# EAGLE design GB PCB - Tetris DX (EAGLE 6.2)
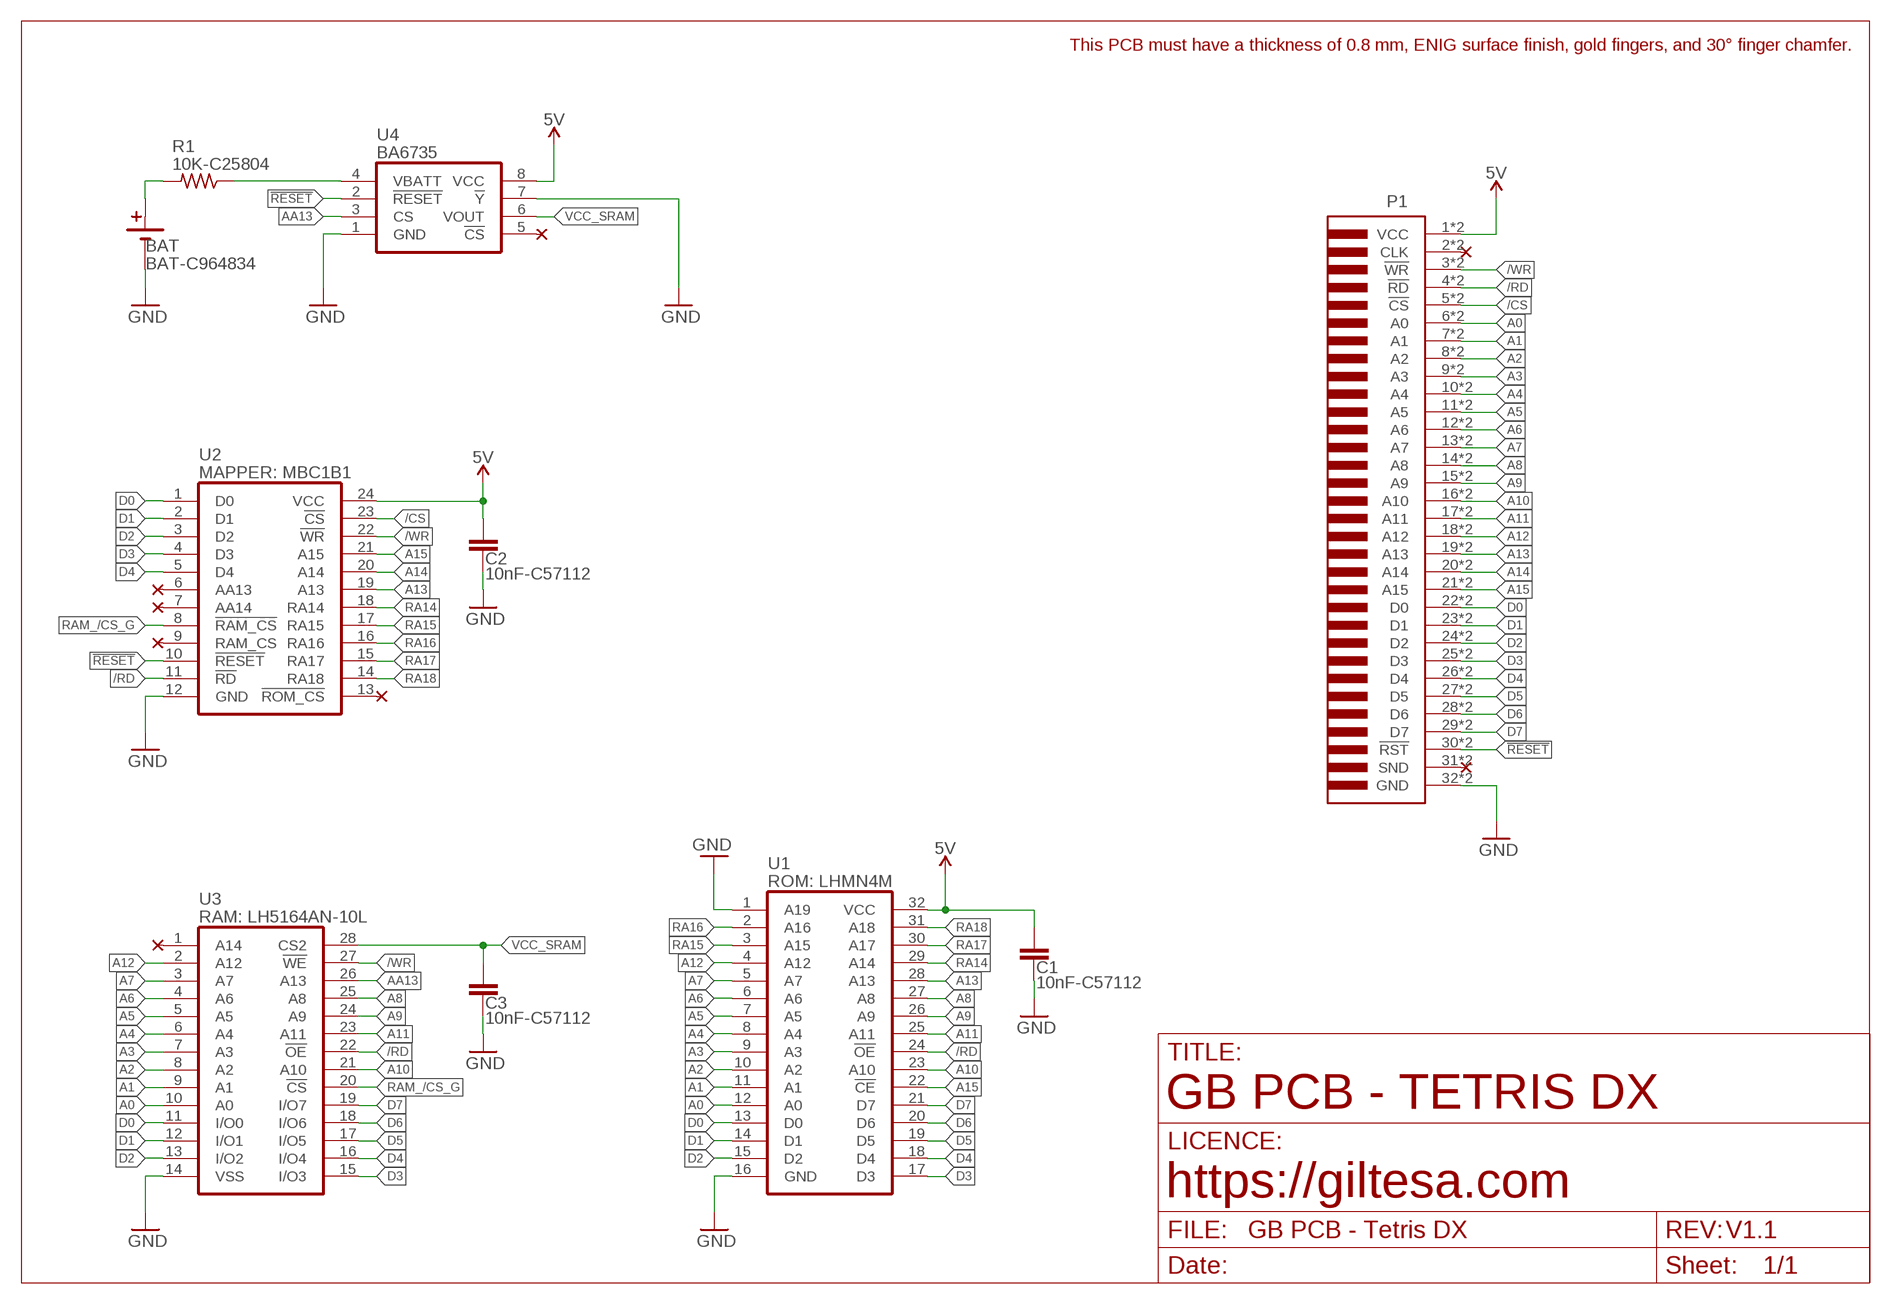
[diagram p0: schematic, sheet 1]

## Parts
BAT  BAT-C964834  CR2032MY-2032-12-R  [CR2032_MY-2032-12-R]
C1  10nF-C57112  C0603"  [C0603]
C2  10nF-C57112  C0603"  [C0603]
C3  10nF-C57112  C0603"  [C0603]
P1  GB_CARTRIDGE  [GB_CARTRIDGE]
R1  10K-C25804  R0603  [R0603]
U1  ROM: LHMN4M  LHMN4M  [LHMN4M]
U2  MAPPER: MBC1B1  MBC1B1  [MBC1B1]
U3  RAM: LH5164AN-10L  LH5164AN-10L  [LH5164AN-10L]
U4  BA6735  [BA6735]

## Nets
5V: C1.2 C2.1 P1.1"(VCC) P1.1(VCC) U1.32(VCC) U2.24(VCC) U4.8(VCC)
!RESET: P1.30"(!RST) P1.30(!RST) U2.10(!RESET) U4.2(!RESET)
/CS: P1.5"(!CS) P1.5(!CS) U2.23(!CS)
/RD: P1.4"(!RD) P1.4(!RD) U1.24(!OE) U2.11(!RD) U3.22(!OE)
/WR: P1.3"(!WR) P1.3(!WR) U2.22(!WR) U3.27(!WE)
A0: P1.6"(A0) P1.6(A0) U1.12(A0) U3.10(A0)
A1: P1.7"(A1) P1.7(A1) U1.11(A1) U3.9(A1)
A2: P1.8"(A2) P1.8(A2) U1.10(A2) U3.8(A2)
A3: P1.9"(A3) P1.9(A3) U1.9(A3) U3.7(A3)
A4: P1.10"(A4) P1.10(A4) U1.8(A4) U3.6(A4)
A5: P1.11"(A5) P1.11(A5) U1.7(A5) U3.5(A5)
A6: P1.12"(A6) P1.12(A6) U1.6(A6) U3.4(A6)
A7: P1.13"(A7) P1.13(A7) U1.5(A7) U3.3(A7)
A8: P1.14"(A8) P1.14(A8) U1.27(A8) U3.25(A8)
A9: P1.15"(A9) P1.15(A9) U1.26(A9) U3.24(A9)
A10: P1.16"(A10) P1.16(A10) U1.23(A10) U3.21(A10)
A11: P1.17"(A11) P1.17(A11) U1.25(A11) U3.23(A11)
A12: P1.18"(A12) P1.18(A12) U1.4(A12) U3.2(A12)
A13: P1.19"(A13) P1.19(A13) U1.28(A13) U2.19(A13)
A14: P1.20"(A14) P1.20(A14) U2.20(A14)
A15: P1.21"(A15) P1.21(A15) U1.22(!CE) U2.21(A15)
AA13: U3.26(A13) U4.3(CS)
D0: P1.22"(D0) P1.22(D0) U1.13(D0) U2.1(D0) U3.11(I/O0)
D1: P1.23"(D1) P1.23(D1) U1.14(D1) U2.2(D1) U3.12(I/O1)
D2: P1.24"(D2) P1.24(D2) U1.15(D2) U2.3(D2) U3.13(I/O2)
D3: P1.25"(D3) P1.25(D3) U1.17(D3) U2.4(D3) U3.15(I/O3)
D4: P1.26"(D4) P1.26(D4) U1.18(D4) U2.5(D4) U3.16(I/O4)
D5: P1.27"(D5) P1.27(D5) U1.19(D5) U3.17(I/O5)
D6: P1.28"(D6) P1.28(D6) U1.20(D6) U3.18(I/O6)
D7: P1.29"(D7) P1.29(D7) U1.21(D7) U3.19(I/O7)
GND: BAT.GND1(B-) BAT.GND2(B-) BAT.GND3(B-) C1.1 C2.2 C3.2 P1.32"(GND) P1.32(GND) U1.1(A19) U1.16(GND) U2.12(GND) U3.14(VSS) U4.1(GND) U4.7(!Y)
N$1: BAT.VCC1(B+) BAT.VCC2(B+) R1.2
N$16: R1.1 U4.4(VBATT)
RA14: U1.29(A14) U2.18(RA14)
RA15: U1.3(A15) U2.17(RA15)
RA16: U1.2(A16) U2.16(RA16)
RA17: U1.30(A17) U2.15(RA17)
RA18: U1.31(A18) U2.14(RA18)
RAM_/CS_G: U2.8(!RAM_CS) U3.20(!CS)
VCC_SRAM [VCC]: C3.1 U3.28(CS2) U4.6(VOUT)
Unconnected: P1.2"(CLK) P1.2(CLK) P1.31"(SND) P1.31(SND) U2.6(AA13) U2.7(AA14) U2.9(RAM_CS) U2.13(!ROM_CS) U3.1(A14) U4.5(!CS)

## Notes on the sheet
- This PCB must have a thickness of 0.8 mm, ENIG surface finish, gold fingers, and 30° finger chamfer.
- GB PCB - TETRIS DX
- https://giltesa.com
- V1.1

## Library data of the parts
BAT = ,giltesa:CR2032
C1-C3 = ,giltesa:C0603
P1 = ,giltesa:GB_CARTRIDGE
R1 = ,giltesa:R0603
U1 = ,giltesa:LHMN4M
U2 = ,giltesa:MBC1B1
U3 = ,giltesa:LH5164AN-10L
U4 = ,giltesa:BA6735

## Net classes
1 VCC: width 0.203 mm
2 GND: width 0.203 mm
3 power usb: width 0.508 mm, drill 0.406 mm, clearance 0.203 mm

## Board
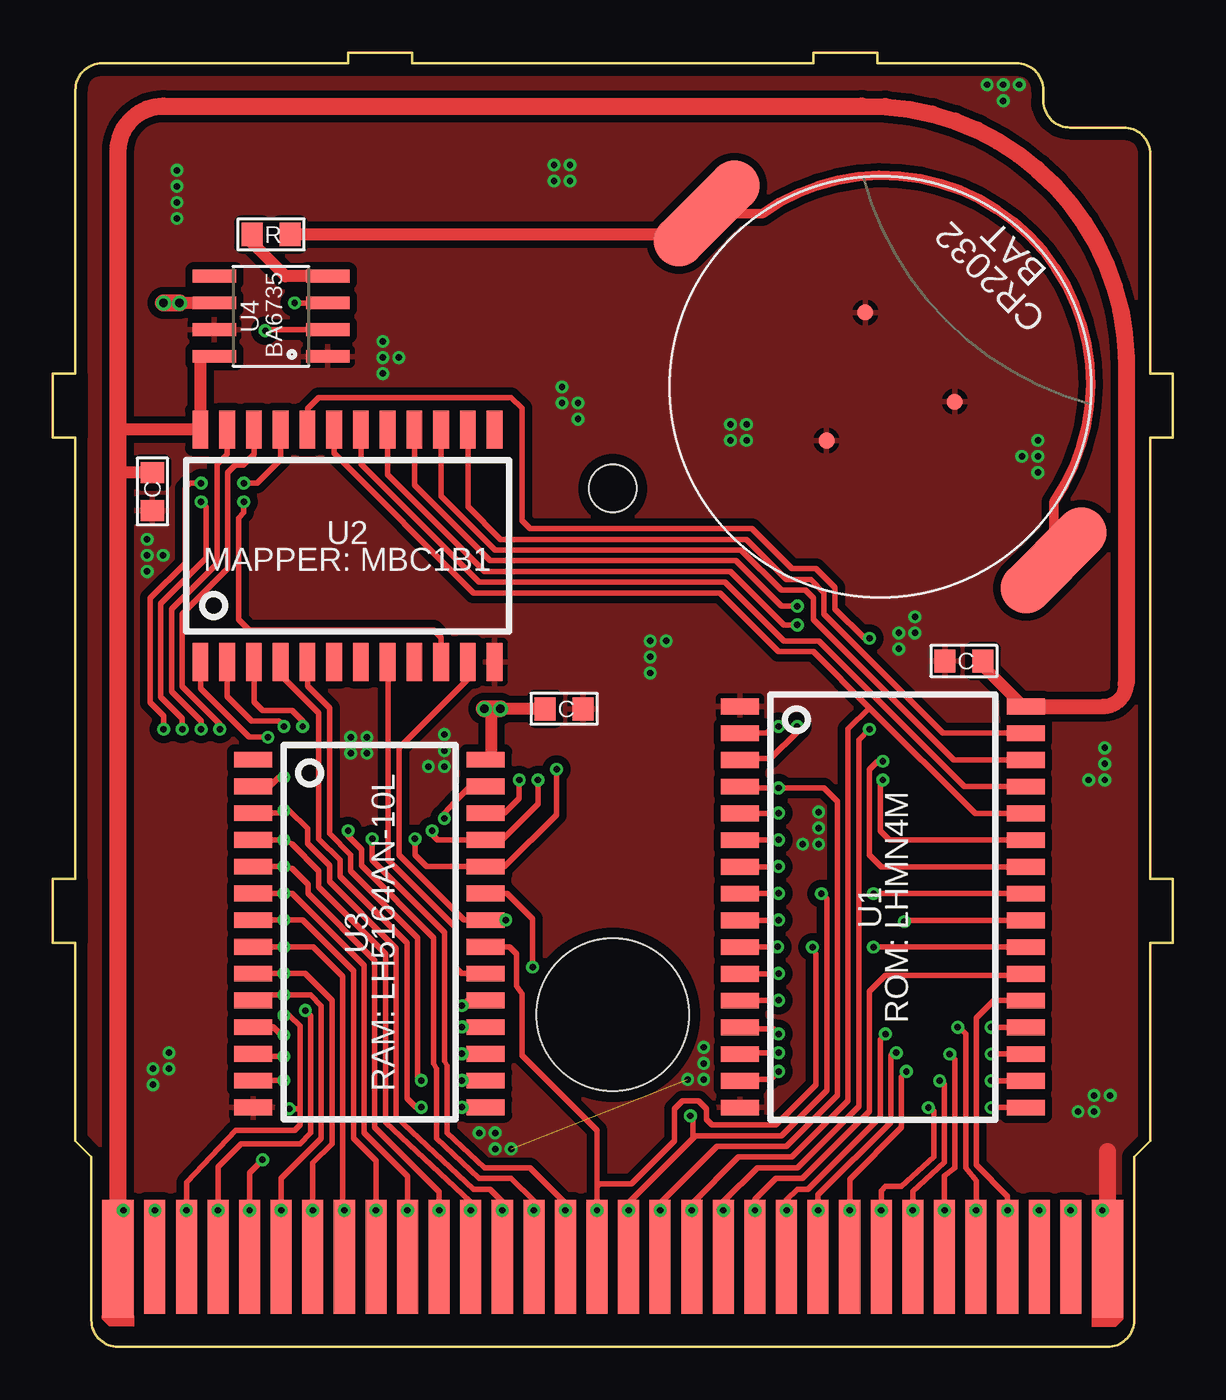
[diagram p1: board, top side]
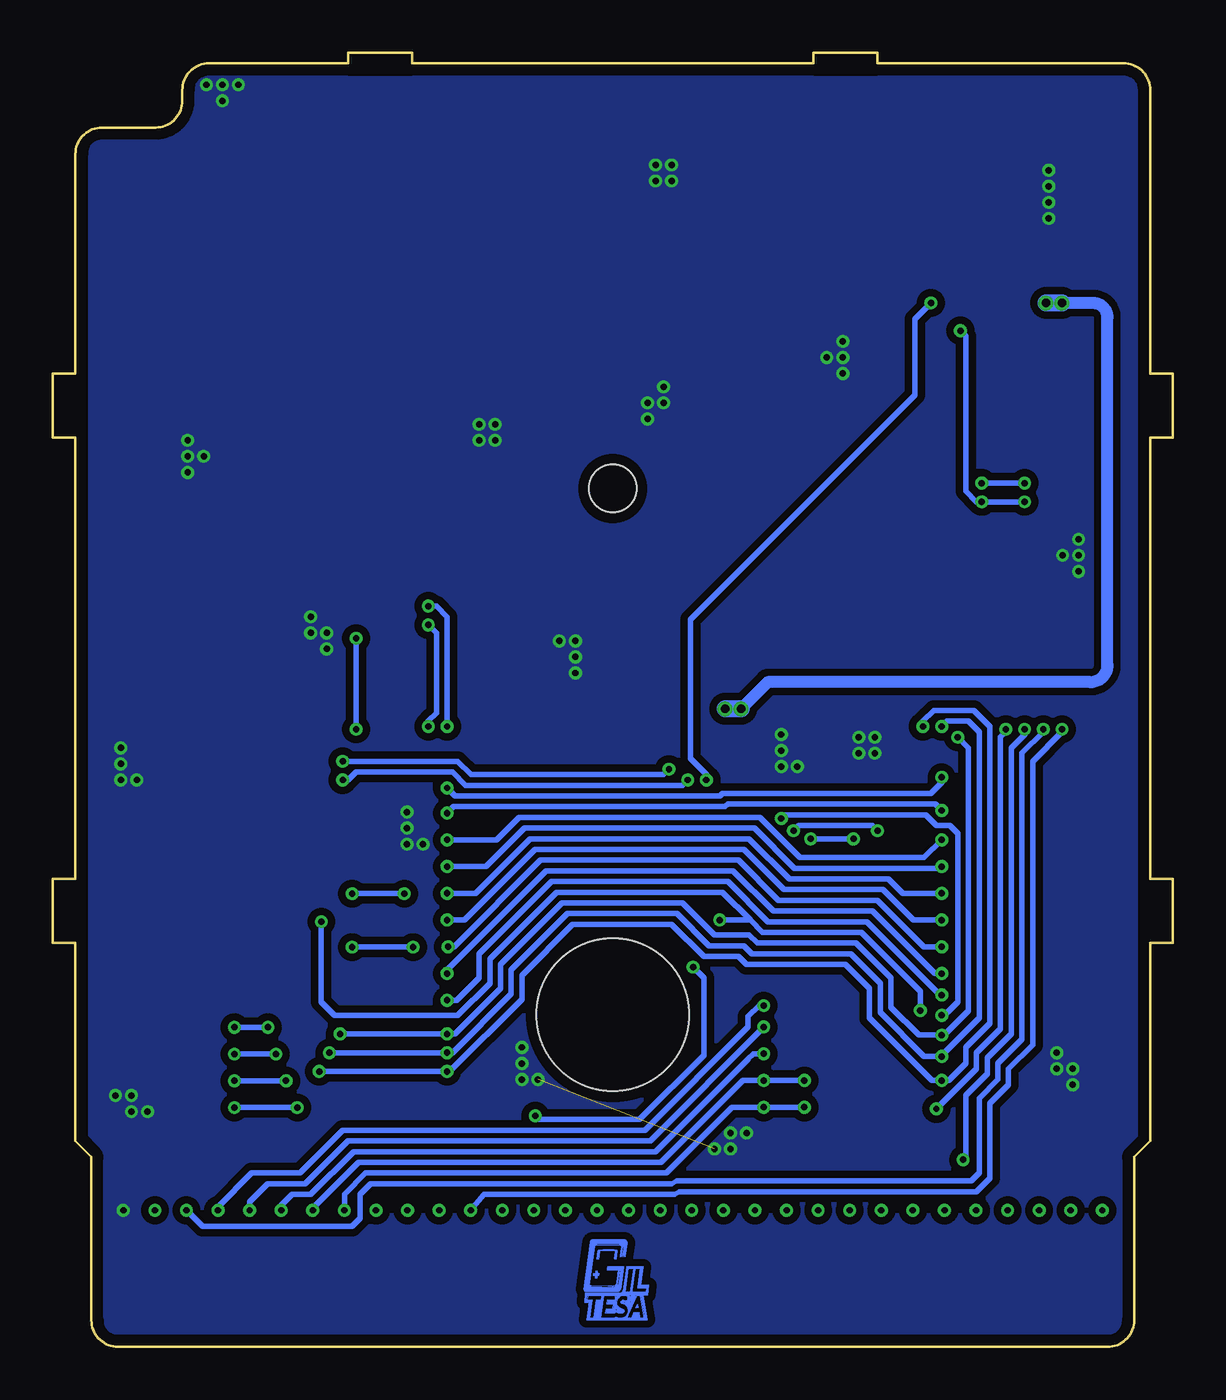
[diagram p2: board, bottom side, seen from below]

Size 53.21 x 61.47 mm. Coordinates in mm from the lower left corner, seen from the top.
Outline: 1.84,9.02 1.84,1.27 arc90 3.11,0 50.1,0 arc90 51.37,1.27 51.37,9.02 52.13,9.78 52.13,19.18 53.21,19.18 53.21,22.23 52.13,22.23 52.13,43.18 53.21,43.18 53.21,46.23 52.13,46.23 52.13,56.64 arc90 50.86,57.91 48.32,57.91 arc-90 47.05,59.18 47.05,59.69 arc90 45.78,60.96 39.18,60.96 39.18,61.47 36.13,61.47 36.13,60.96 17.08,60.96 17.08,61.47 14.03,61.47 14.03,60.96 2.35,60.96 arc90 1.08,59.69 1.08,46.23 0,46.23 0,43.18 1.08,43.18 1.08,22.23 0,22.23 0,19.18 1.08,19.18 1.08,9.78 1.84,9.02
Copper layers (1*16): Top 0.035mm / dielectric 1.6mm / Bottom 0.035mm
Design rules: minimum track width 6mil, minimum drill 12mil, track to track 6mil, track to pad 6mil, pad to pad 6mil, via to via 8mil, smd to smd 0mil, copper to edge 20mil, drill to drill 10mil, minimum pad ring 6mil, minimum via ring 6mil, stop-mask expansion 0mil, vias tented up to drill 100mil, thermal gap 10mil

### Footprints (pad centres in the part's own frame; a part is rotated, then mirrored left to right if it is on the bottom)
CR2032_MY-2032-12-R = smd 0.75 x 0.75: GND1 -3,2; GND2 3,2; GND3 0,-3.607 | smd 2.4 x 6.1: VCC1 -11.65,0; VCC2 11.65,0
C0603 = smd 1 x 1.1: 1 -0.901,0; 2 0.901,0
GB_CARTRIDGE = smd 1.5 x 5.6: 1 -23.5,-26.305; 32 23.5,-26.305 | drill 0.305: 1" -23.25,-23.995; 2" -21.75,-23.995; 3" -20.25,-23.995; 4" -18.75,-23.995; 5" -17.25,-23.995; 6" -15.75,-23.995; 7" -14.25,-23.995; 8" -12.75,-23.995; 9" -11.25,-23.995; 10" -9.75,-23.995; 11" -8.25,-23.995; 12" -6.75,-23.995; 13" -5.25,-23.995; 14" -3.75,-23.995; 15" -2.25,-23.995; 16" -0.75,-23.995; 17" 0.75,-23.995; 18" 2.25,-23.995; 19" 3.75,-23.995; 20" 5.25,-23.995; 21" 6.75,-23.995; 22" 8.25,-23.995; 23" 9.75,-23.995; 24" 11.25,-23.995; 25" 12.75,-23.995; 26" 14.25,-23.995; 27" 15.75,-23.995; 28" 17.25,-23.995; 29" 18.75,-23.995; 30" 20.25,-23.995; 31" 21.75,-23.995; 32" 23.25,-23.995 | smd 1 x 5.4: 2 -21.75,-26.205; 3 -20.25,-26.205; 4 -18.75,-26.205; 5 -17.25,-26.205; 6 -15.75,-26.205; 7 -14.25,-26.205; 8 -12.75,-26.205; 9 -11.25,-26.205; 10 -9.75,-26.205; 11 -8.25,-26.205; 12 -6.75,-26.205; 13 -5.25,-26.205; 14 -3.75,-26.205; 15 -2.25,-26.205; 16 -0.75,-26.205; 17 0.75,-26.205; 18 2.25,-26.205; 19 3.75,-26.205; 20 5.25,-26.205; 21 6.75,-26.205; 22 8.25,-26.205; 23 9.75,-26.205; 24 11.25,-26.205; 25 12.75,-26.205; 26 14.25,-26.205; 27 15.75,-26.205; 28 17.25,-26.205; 29 18.75,-26.205; 30 20.25,-26.205; 31 21.75,-26.205 | hole 7.25: 0,-14.705 | hole 2.25: 0,10.29
R0603 = smd 1 x 1.1: 1 -0.901,0; 2 0.901,0
LHMN4M = smd 0.75 x 1.8: 1 -9.538,-6.79; 2 -8.268,-6.79; 3 -6.998,-6.79; 4 -5.728,-6.79; 5 -4.458,-6.79; 6 -3.188,-6.79; 7 -1.918,-6.79; 8 -0.648,-6.79; 9 0.622,-6.79; 10 1.892,-6.79; 11 3.162,-6.79; 12 4.432,-6.79; 13 5.702,-6.79; 14 6.972,-6.79; 15 8.242,-6.79; 16 9.512,-6.79; 17 9.512,6.79; 18 8.242,6.79; 19 6.972,6.79; 20 5.702,6.79; 21 4.432,6.79; 22 3.162,6.79; 23 1.892,6.79; 24 0.622,6.79; 25 -0.648,6.79; 26 -1.918,6.79; 27 -3.188,6.79; 28 -4.458,6.79; 29 -5.728,6.79; 30 -6.998,6.79; 31 -8.268,6.79; 32 -9.538,6.79
MBC1B1 = smd 0.75 x 1.8: 1 -6.985,-5.521; 2 -5.715,-5.521; 3 -4.445,-5.521; 4 -3.175,-5.521; 5 -1.905,-5.521; 6 -0.635,-5.521; 7 0.635,-5.521; 8 1.905,-5.521; 9 3.175,-5.521; 10 4.445,-5.521; 11 5.715,-5.521; 12 6.985,-5.521; 13 6.985,5.521; 14 5.715,5.521; 15 4.445,5.521; 16 3.175,5.521; 17 1.905,5.521; 18 0.635,5.521; 19 -0.635,5.521; 20 -1.905,5.521; 21 -3.175,5.521; 22 -4.445,5.521; 23 -5.715,5.521; 24 -6.985,5.521
LH5164AN-10L = smd 0.75 x 1.8: 1 -8.204,-5.521; 2 -6.934,-5.521; 3 -5.664,-5.521; 4 -4.394,-5.521; 5 -3.124,-5.521; 6 -1.854,-5.521; 7 -0.584,-5.521; 8 0.686,-5.521; 9 1.956,-5.521; 10 3.226,-5.521; 11 4.496,-5.521; 12 5.766,-5.521; 13 7.036,-5.521; 14 8.306,-5.521; 15 8.306,5.521; 16 7.036,5.521; 17 5.766,5.521; 18 4.496,5.521; 19 3.226,5.521; 20 1.956,5.521; 21 0.686,5.521; 22 -0.584,5.521; 23 -1.854,5.521; 24 -3.124,5.521; 25 -4.394,5.521; 26 -5.664,5.521; 27 -6.934,5.521; 28 -8.204,5.521
BA6735 = smd 0.61 x 2.057: 1 -1.905,-2.692; 2 -0.635,-2.692; 3 0.635,-2.692; 4 1.905,-2.692; 5 1.905,2.692; 6 0.635,2.692; 7 -0.635,2.692; 8 -1.905,2.692

### Placement (x,y rotation side)
BAT  39.31,45.59 315 top
C1  43.28,32.58 0 top
C2  4.74,40.63 270 top
C3  24.3,30.3 0 top
P1  26.61,30.48 0 top
R1  10.38,52.83 0 top
U1  39.43,20.88 270 top
U2  14.01,38.05 0 top
U3  15.05,19.69 270 top
U4  10.38,48.95 90 top
U$12  [GILTESA_LOGO_COPPER]  28,1.27 0 bottom
U$13  [GILTESA.COM_7MM_STOP]  42.85,2.51 0 bottom

### Tracks (layer width: path | path; a pad name or v marks a point on that pad's centre or on a via)
5V
  Top 0.254: 3.11,1.38 P1.1
  Top 0.406: C1.2 44.13,32.58 44.13,32.89 44.18,32.89 44.18,32.33
  Top 0.559: 3.11,47.04 3.11,46.99 | 3.11,43.57 U2.24 7.02,46.97 7.1,47.04 U4.8 | C2.1 3.11,41.53 3.11,41.91 | P1.1 3.11,6.23 P1.1" | 44.18,32.33 46.1,30.42 U1.32
  Top 0.711: U1.32 49.91,30.42 arc90 50.99,31.5
  Top 0.813: 50.99,31.5 50.99,46.99 arc90 38.42,58.93 5.27,58.93 arc90 3.11,56.76 3.11,46.99 3.11,43.57 3.11,41.91 P1.1
!RESET  (via drill 0.3)
  Top 0.254: P1.30 P1.30" | U2.10 18.45,33.68 18.1,34.04 9.33,34.04 8.83,34.54 8.83,39.37 9.08,39.62 v9.08,40.13 | U4.2 10.15,48.31 v10.1,48.26 | v7.05,40.13 7.3,39.88 7.3,37.47 5.14,35.31 5.14,30.86 6.16,29.84 v6.16,29.34
  Bottom 0.254: v7.05,40.13 v9.08,40.13 9.33,40.13 9.84,40.64 9.84,48.01 v10.1,48.26 | v6.16,29.34 6.16,29.21 7.18,28.19 7.18,14.61 8.32,13.46 8.32,12.7 9.21,11.81 9.21,8.25 9.59,7.87 23.56,7.87 23.81,7.75 38.1,7.75 38.61,7.24 38.61,6.1 38.99,5.71 46.09,5.71 P1.30"
/CS  (via drill 0.3)
  Top 0.254: P1.5 P1.5" 9.36,8.28 v9.97,8.89 | U2.23 8.29,42.39 7.81,41.91 7.81,37.21 5.65,35.05 5.65,31.12 7.05,29.72 v7.05,29.34
  Bottom 0.254: v7.05,29.34 7.05,29.08 7.68,28.45 7.68,14.86 8.83,13.72 8.83,12.95 9.84,11.94 9.84,9.02 v9.97,8.89
/RD  (via drill 0.3)
  Top 0.254: P1.4 P1.4" | P1.4" 7.86,6.78 | P1.4" 7.86,8.55 8.95,9.65 11.75,9.65 12.26,10.16 12.26,15.72 v12,15.98 | v21.53,20.27 U3.22 19.55,20.27 16.45,23.37 16.45,28.45 19.72,31.73 U2.11 | U1.24 40.51,20.26 v40.45,20.19
  Bottom 0.254: 20.08,20.27 19.49,19.69 14.8,19.69 12,16.89 v12,15.98 | 20.08,20.27 21.4,21.59 29.27,21.59 32.45,18.41 32.45,17.27 33.97,15.75 39.81,15.75 40.45,16.38 v40.45,20.19 | v21.53,20.27 20.08,20.27
/WR  (via drill 0.3)
  Top 0.254: P1.3 P1.3" 6.36,7.82 8.7,10.29 11.49,10.29 11.75,10.54 11.75,11.3 | U2.22 9.56,42.39 9.06,41.88 8.67,41.88 8.32,41.53 8.32,36.96 6.16,34.8 6.16,31.37 7.94,29.59 v7.94,29.34 | U3.27 19.82,26.62 19.11,25.91 18.61,25.35 v18.61,25.09 | v10.99,15.75 11.24,15.75 11.75,15.24 11.75,11.3 | v11.24,11.3 11.75,11.3
  Bottom 0.254: v10.99,15.75 10.86,15.75 10.22,16.38 10.22,24.38 10.6,24.77 11.24,24.77 11.75,25.27 18.43,25.27 v18.61,25.09 | v7.94,29.34 7.94,29.21 8.19,28.96 8.19,15.11 9.33,13.97 9.33,13.21 v11.24,11.3
A0  (via drill 0.3)
  Top 0.254: U1.12 34.47,16.45 v34.48,16.46 | P1.6 P1.6" 10.86,8 12.76,9.91 12.76,16.2 12.26,16.71 v10.99,16.71 9.91,16.71 U3.10 9.79,16.46 9.97,16.64
  Bottom 0.254: v34.48,16.46 34.47,16.45 34.04,16.45 32.96,17.53 32.96,18.67 29.53,22.1 21.15,22.1 19.24,20.19 14.54,20.19 11.06,16.71 v10.99,16.71
A1  (via drill 0.3)
  Top 0.254: U3.9 v10.99,17.73 12,17.73 13.27,16.46 13.27,9.65 12.36,8.74 P1.7" P1.7 | U1.11 34.47,17.72 v34.48,17.73
  Bottom 0.254: v34.48,17.73 34.48,17.91 29.78,22.61 20.89,22.61 18.99,20.7 14.29,20.7 11.32,17.73 v10.99,17.73
A2  (via drill 0.3)
  Top 0.254: U3.8 v10.99,19 12.38,19 13.78,17.6 13.78,6.66 P1.8" P1.8 | U1.10 34.47,18.99 v34.43,19
  Bottom 0.254: v34.43,19 34.15,19 30.04,23.11 20.64,23.11 18.73,21.21 14.03,21.21 11.82,19 v10.99,19
A3  (via drill 0.3)
  Top 0.254: U3.7 v10.99,20.27 11.87,20.27 14.29,17.86 14.29,9.91 15.36,8.84 P1.9" P1.9 | U1.9 34.47,20.26 v34.48,20.27
  Bottom 0.254: v34.48,20.27 33.64,20.27 30.29,23.62 20.38,23.62 18.48,21.72 13.78,21.72 12.33,20.27 v10.99,20.27
A4  (via drill 0.3)
  Top 0.254: U3.6 v10.99,21.54 11.37,21.54 14.8,18.11 14.8,10.16 16.86,8.1 P1.10" P1.10 | U1.8 34.47,21.53 v34.48,21.54
  Bottom 0.254: v34.48,21.54 33.13,21.54 30.54,24.13 20.63,24.13 20.13,24.13 18.22,22.23 13.53,22.23 12.84,21.54 v10.99,21.54
A5  (via drill 0.3)
  Top 0.254: U3.5 v10.99,22.81 11.37,22.73 12.13,21.97 12.13,21.54 15.3,18.36 15.3,10.41 18.36,7.36 P1.11" P1.11 | U1.7 34.47,22.8 v34.48,22.81
  Bottom 0.254: v34.48,22.81 32.63,22.81 30.8,24.64 19.88,24.64 17.97,22.73 11.06,22.73 v10.99,22.81
A6  (via drill 0.3)
  Top 0.254: U3.4 v10.99,24.08 11.37,23.88 12.64,22.61 12.64,21.84 15.81,18.67 15.81,10.67 19.86,6.88 P1.12" P1.12 | U1.6 34.47,24.07 v34.48,24.08
  Bottom 0.254: v34.48,24.08 32.12,24.08 31.05,25.15 19.62,25.15 17.72,23.24 11.82,23.24 v10.99,24.08
A7  (via drill 0.3)
  Top 0.254: U1.5 34.59,25.34 v34.48,25.35 | P1.13 P1.13" 21.36,6.9 20.76,7.49 20,7.49 16.32,10.92 16.32,18.92 13.14,22.1 13.14,22.86 12.1,23.9 12.1,24.61 11.24,25.48 v10.99,25.48 10.86,25.35 U3.3
  Bottom 0.254: v34.48,25.35 34.18,25.65 21.27,25.65 21.15,25.78 11.29,25.78 v10.99,25.48
A8  (via drill 0.3)
  Top 0.254: P1.14 P1.14" 22.86,6.93 21.78,8 20.26,8 18.22,9.91 18.22,13.21 18.1,13.46 18.1,19.43 14.67,22.86 14.67,23.62 14.03,24.26 v14.03,24.51 | v23.05,26.92 23.05,25.78 21.35,24.08 U3.25 18.28,24.08 18.02,24.33 v18.02,24.51 | v39.43,26.92 39.31,26.8 39.31,24.51 39.75,24.07 U1.27
  Bottom 0.254: v23.05,26.92 23.3,26.67 33.59,26.67 34.23,27.3 38.8,27.3 39.18,26.92 v39.43,26.92 | v14.03,24.51 14.29,24.77 17.77,24.77 v18.02,24.51
A9  (via drill 0.3)
  Top 0.254: P1.15 P1.15" 24.36,6.82 22.67,8.51 20.51,8.51 18.73,10.16 18.73,13.34 18.61,13.59 18.61,19.69 15.18,23.11 v15.18,24.13 | v23.94,27.43 23.94,25.27 21.48,22.81 U3.24 17.77,22.81 17.21,23.37 v17.21,24.13 | v39.43,27.81 39.18,27.81 38.8,27.43 38.8,23.37 39.37,22.8 U1.26
  Bottom 0.254: v39.43,27.81 33.97,27.81 33.34,27.18 24.19,27.18 v23.94,27.43 | v15.18,24.13 v17.21,24.13
A10  (via drill 0.3)
  Top 0.254: P1.16 P1.16" 25.86,7.62 | U1.23 v38.99,18.99 | v36.09,18.99 36.26,18.67 36.26,12.45 34.35,10.54 31.31,10.54 31.05,10.8 31.05,11.3 30.67,11.68 29.91,11.68 29.53,11.3 29.53,9.78 27.5,7.75 25.98,7.75 25.86,7.62 | U3.21 21.7,19 22.03,18.67 22.03,17.14 22.29,16.76 22.29,13.84 25.86,10.28 25.86,7.62
  Bottom 0.254: v38.99,18.99 v36.09,18.99
A11  (via drill 0.3)
  Top 0.254: P1.17 P1.17" 27.36,6.85 30.42,9.91 | U1.25 v38.99,21.53 | v36.51,21.53 36.77,21.27 36.77,12.19 34.61,10.03 30.54,10.03 30.42,9.91 | v22.8,18.03 22.8,20.32 21.58,21.54 U3.23 | 30.42,9.91 30.42,10.85 v30.29,10.97
  Bottom 0.254: v38.99,21.53 v36.51,21.53 | v30.29,10.97 30.16,10.8 25.34,10.8 22.29,13.84 22.29,17.53 v22.8,18.03
A12  (via drill 0.3)
  Top 0.254: P1.18 P1.18" 28.86,6.82 31.56,9.53 34.86,9.53 37.27,11.94 37.27,25.91 36.64,26.54 v34.48,26.54 32.96,26.54 32.83,26.67 U1.4 | U3.2 10.3,26.62 10.73,27.05 v10.99,27.05
  Bottom 0.254: v34.48,26.54 34.1,26.16 21.53,26.16 21.4,26.29 11.49,26.29 10.99,26.8 v10.99,27.05
A13
  Top 0.254: P1.19 P1.19" 30.36,6.8 32.58,9.02 35.12,9.02 37.78,11.68 37.78,29.34 38.8,30.35 | 38.8,30.35 36.13,33.02 34.48,33.02 31.69,35.81 20,35.81 13.37,42.44 U2.19 | 38.8,30.35 43.82,25.34 U1.28
A14  (via drill 0.3)
  Top 0.254: P1.20 P1.20" 31.86,6.9 33.46,8.51 35.37,8.51 38.29,11.43 38.29,28.83 v38.8,29.34 | U2.20 12.1,44.55 12.64,45.09 21.78,45.09 22.29,44.58 22.29,39.24 22.67,38.86 33.21,38.86 35.12,36.96 36.26,36.96 37.15,36.07 37.15,35.05 38.54,33.66 v38.8,33.66
  Bottom 0.254: v38.8,29.34 v38.8,33.66
A15  (via drill 0.3)
  Top 0.254: P1.21 P1.21" | U1.22 46.03,17.65 39.56,17.65 38.8,16.89 38.8,11.18 35.62,8 34.35,8 33.36,7 P1.21" | P1.21" 33.36,6.75 | U2.21 10.83,42.14 9.72,41.02 v9.08,41.02 | v7.05,41.02 6.54,41.02 6.29,40.77 6.29,37.21 4.64,35.56 4.64,30.61 5.27,29.97 v5.27,29.34
  Bottom 0.254: v9.08,41.02 v7.05,41.02 | v5.27,29.34 5.27,29.21 6.67,27.81 6.67,14.35 7.81,13.21 7.81,12.45 8.7,11.56 8.7,8 9.33,7.37 23.43,7.37 23.69,7.24 32.73,7.24 P1.21"
AA13  (via drill 0.3)
  Top 0.254: U4.3 v11.49,49.58 | U3.26 21.48,25.35 22.16,26.04 v22.16,26.92
  Bottom 0.254: v11.49,49.58 12.26,48.82 12.26,45.21 22.92,34.54 22.92,27.94 22.16,27.18 v22.16,26.92
D0  (via drill 0.3)
  Top 0.254: P1.22 P1.22" 34.86,6.98 35.37,7.49 35.88,7.49 39.31,10.92 39.31,14.61 v39.56,14.86 | 32.83,15.11 33.21,15.11 | 33.21,15.11 34.23,15.11 v34.48,14.86 | U1.13 33.15,15.18 33.21,15.11 | U3.11 10.48,15.19 10.86,14.81 v10.99,14.81 | U2.1 7.02,31.27 9.33,28.96 v10.22,28.96
  Bottom 0.254: v39.56,14.86 v34.48,14.86 34.1,14.86 31.94,17.02 31.94,18.16 29.02,21.08 23.3,21.08 21.78,19.56 20.13,19.56 19.75,19.18 15.05,19.18 13.4,17.53 13.4,16.13 12.08,14.81 v10.99,14.81 10.86,14.81 9.72,15.95 9.72,28.45 v10.22,28.96
D1  (via drill 0.3)
  Top 0.254: P1.23 P1.23" 36.36,7.21 39.81,10.67 39.81,13.84 39.94,13.97 v40.07,13.97 | v34.48,13.97 32.83,13.97 U1.14 | U3.12 9.78,13.79 v10.99,13.79 | U2.2 8.29,30.89 9.46,29.72 10.73,29.72 v10.99,29.46
  Bottom 0.254: v40.07,13.97 v34.48,13.97 34.23,13.97 31.43,16.76 31.43,17.91 28.77,20.57 23.56,20.57 22.03,19.05 20.38,19.05 20,18.67 15.3,18.67 13.91,17.27 13.91,15.88 11.82,13.79 v10.99,13.79 11.04,13.79 9.21,15.62 9.21,29.21 9.72,29.72 10.73,29.72 v10.99,29.46
D2  (via drill 0.3)
  Top 0.254: P1.24 P1.24" 37.86,7.95 40.32,10.41 40.32,12.83 v40.55,13.08 | v34.48,13.08 34.1,12.7 32.83,12.7 U1.15 | U3.13 v10.99,12.65 | U2.3 9.56,30.63 9.97,30.23 11.37,30.23 11.87,29.72 v11.87,29.46
  Bottom 0.254: v40.55,13.08 v34.48,13.08 34.35,13.08 30.92,16.51 30.92,17.65 28.51,20.07 23.81,20.07 22.29,18.54 20.64,18.54 20.26,18.16 15.56,18.16 14.41,17.02 14.41,15.62 11.44,12.65 v10.99,12.65 10.66,12.65 9.84,13.46 9.84,14.22 8.7,15.37 8.7,29.46 9.46,30.23 11.37,30.23 11.87,29.72 v11.87,29.46
D3  (via drill 0.3)
  Top 0.254: U1.17 v44.58,11.37 | v41.59,11.37 41.66,11.37 41.85,11.18 41.85,9.02 40.32,7.62 39.56,7.62 39.36,7.42 P1.25" P1.25 | U2.4 10.83,31.9 12.64,30.1 12.64,24.13 13.65,23.11 13.65,22.35 16.83,19.18 16.83,11.81 17.26,11.38 v17.51,11.38 | U3.15 v19.44,11.38
  Bottom 0.254: v44.58,11.37 v41.59,11.37 | P1.25" 39.36,7.25 38.35,8.25 24.07,8.25 20.94,11.38 v19.44,11.38 v17.51,11.38
D4  (via drill 0.3)
  Top 0.254: P1.26 P1.26" 40.86,7.39 42.35,8.76 42.35,12.47 42.16,12.64 v42.13,12.64 | U1.18 v44.58,12.64 | U2.5 12.1,31.39 13.14,30.35 13.14,24.38 14.16,23.37 14.16,22.61 17.34,19.43 17.34,12.83 v17.51,12.65 | U3.16 v19.44,12.65
  Bottom 0.254: v44.58,12.64 v42.13,12.64 | v17.51,12.65 v19.44,12.65 20.43,12.65 24.32,8.76 38.67,8.76 40.86,6.58 P1.26"
D5  (via drill 0.3)
  Top 0.254: P1.27 P1.27" 42.36,8.13 42.86,8.51 42.86,13.65 v42.61,13.91 | U1.19 v44.58,13.91 | U3.17 v19.44,13.92
  Bottom 0.254: v44.58,13.91 v42.61,13.91 | v19.44,13.92 19.94,13.92 20.18,13.67 20.18,13.66 24.57,9.27 38.93,9.27 40.96,7.24 41.85,7.24 42.36,6.73 P1.27"
D6  (via drill 0.3)
  Top 0.254: P1.28 P1.28" 43.88,6.51 43.88,7.87 43.37,8.51 43.37,14.86 43.05,15.18 v42.99,15.18 | U1.20 v44.58,15.18 | U3.18 v19.44,15.19
  Bottom 0.254: v44.58,15.18 v42.99,15.18 | v19.44,15.19 19.42,15.19 24.83,9.78 39.18,9.78 41.21,7.75 42.99,7.75 43.86,6.88 P1.28"
D7  (via drill 0.3)
  Top 0.254: P1.29 P1.29" 45.36,7.16 43.88,8.64 43.88,15.62 44.7,16.45 U1.21 | U3.19 19.7,16.46 v19.44,16.2
  Bottom 0.254: v19.44,16.2 19.67,16.2 20.18,15.7 20.18,15.19 25.08,10.29 39.43,10.29 41.47,8.25 43.75,8.25 45.36,6.65 P1.29"
GND  (via drill 0.3)  (1 unrouted)
  Top 0.254: 50.11,1.38 P1.32
  Top 0.813: P1.32 50.11,9.28
  other vias: 4.76,12.45 4.76,13.21 48.7,11.18 49.47,11.94 28.38,32.77 28.38,32 40.96,33.91 40.2,33.91 24.96,44.07 24.19,44.83 24.57,56.13 4.48,38.35 4.48,37.59 4.48,36.83 5.25,37.59 24.19,45.59 24.96,44.83 23.81,56.13 23.81,55.37 24.57,55.37 28.38,33.53 29.15,33.53 40.96,34.67 40.2,33.15 49.47,11.18 50.23,11.94 49.21,26.92 49.97,26.92 49.97,27.69 49.97,28.45 5.52,13.21 5.52,13.97 5.91,55.88 5.91,55.12 5.91,54.36 5.91,53.59 45.15,59.18 45.15,59.94 44.39,59.94 45.91,59.94 15.68,46.23 15.68,46.99 15.68,47.75 16.45,46.99 18.61,29.08 18.61,28.32 18.61,27.56 17.84,27.56 14.16,28.96 14.16,28.19 14.92,28.19 14.92,28.96 30.92,14.22 30.92,13.46 30.92,12.7 30.16,12.7 46.04,42.29 46.8,42.29 46.8,41.53 46.8,43.05 32.19,43.81 32.19,43.05 32.96,43.05 32.96,43.81 20.26,10.16 21.02,10.16 21.02,9.4 21.78,9.4 36.39,25.4 36.39,24.64 36.39,23.88 35.62,23.88
  pour Top (isolate 0.356): 1.77,60.27 51.45,60.27 51.45,6.1 1.77,6.1
  pour Bottom (isolate 0.356): 1.77,60.27 51.45,60.27 51.45,-2 1.77,-2
N$1
  Top 0.457: 29.56,52.83 BAT.VCC1 33.72,53.83 arc-160 47.54,40.13 BAT.VCC2
  Top 0.559: 29.56,52.83 R1.2
N$16
  Top 0.559: U4.4 11.06,50.85 9.48,52.44 R1.1
RA14
  Top 0.254: U1.29 43.31,26.61 36.39,33.53 34.73,33.53 31.94,36.32 20.26,36.32 14.64,41.94 U2.18
RA15  (via drill 0.3)
  Top 0.254: U1.3 32.83,27.94 34.1,27.94 35.37,29.21 v35.37,29.46 | U2.17 15.91,41.43 20.51,36.83 32.19,36.83 34.73,34.29 v35.37,34.29
  Bottom 0.254: v35.37,34.29 34.99,33.91 34.99,30.1 35.37,29.72 v35.37,29.46
RA16  (via drill 0.3)
  Top 0.254: 32.83,29.21 U1.2 33.91,29.15 34.23,29.46 v34.48,29.46 | U2.16 17.18,40.92 20.76,37.34 32.45,37.34 34.61,35.18 v35.37,35.18
  Bottom 0.254: v35.37,35.18 34.99,35.18 34.48,34.67 v34.48,29.46
RA17
  Top 0.254: U1.30 42.8,27.88 36.13,34.54 36.13,35.56 35.75,35.94 34.61,35.94 32.7,37.85 21.02,37.85 18.45,40.41 U2.15
RA18
  Top 0.254: U1.31 42.29,29.15 36.64,34.8 36.64,35.81 36,36.45 34.86,36.45 32.96,38.35 21.27,38.35 19.72,39.9 U2.14
RAM_/CS_G
  Top 0.254: 20.37,17.65 U3.20 19.42,17.73 19.11,18.03 19.11,19.94 15.94,23.11 15.94,32.63 U2.8
VCC_SRAM  (via drill 0.41)
  Top 0.559: C3.1 v21.27,30.3 20.57,30.3 | U4.6 v6.03,49.58 | U3.28 20.84,27.89 20.84,30.3 v20.51,30.3
  Top 0.813: v21.27,30.3 v20.51,30.3 | v6.03,49.58 v5.27,49.58
  Bottom 0.559: v5.27,49.58 3.8,49.58 arc90 3.11,48.89 3.11,32.38 arc90 3.92,31.57 19.24,31.57 v20.51,30.3
  Bottom 0.813: v5.27,49.58 v6.03,49.58 | v20.51,30.3 v21.27,30.3

### Text on the board
tPlace: R | BAT | CR2032 | C | C | C
bStop: 2024/05 V1.1